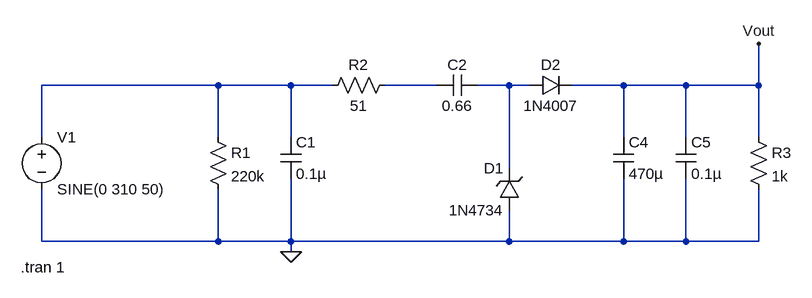
[diagram p0: schematic Transformerless.asc]
Transformerless.asc, the LTspice schematic file:
Version 4
SHEET 1 1796 680
WIRE 208 64 -64 64
WIRE 320 64 208 64
WIRE 384 64 320 64
WIRE 544 64 464 64
WIRE 656 64 608 64
WIRE 688 64 656 64
WIRE 832 64 752 64
WIRE 928 64 832 64
WIRE 1040 64 1040 0
WIRE 1040 64 928 64
WIRE -64 144 -64 64
WIRE 208 144 208 64
WIRE 320 144 320 64
WIRE 832 144 832 64
WIRE 928 144 928 64
WIRE 1040 144 1040 64
WIRE 656 192 656 64
WIRE -64 304 -64 224
WIRE 208 304 208 224
WIRE 208 304 -64 304
WIRE 320 304 320 208
WIRE 320 304 208 304
WIRE 656 304 656 256
WIRE 656 304 320 304
WIRE 832 304 832 208
WIRE 832 304 656 304
WIRE 928 304 928 208
WIRE 928 304 832 304
WIRE 1040 304 1040 224
WIRE 1040 304 928 304
WIRE 320 320 320 304
FLAG 320 320 0
FLAG 1040 0 Vout
SYMBOL voltage -64 128 R0
WINDOW 123 0 0 Left 0
WINDOW 39 0 0 Left 0
SYMATTR InstName V1
SYMATTR Value SINE(0 310 50)
SYMBOL res 192 128 R0
SYMATTR InstName R1
SYMATTR Value 220k
SYMATTR SpiceLine pwr=0.25
SYMBOL cap 304 144 R0
SYMATTR InstName C1
SYMATTR Value 0.1µ
SYMATTR SpiceLine V=275 Irms=0 Rser=0.072 Lser=4.703n mfg="Würth Elektronik" pn="890324025017 WCAP-FTX2 15x18x12x6" type="X2"
SYMBOL res 480 48 R90
WINDOW 0 0 56 VBottom 2
WINDOW 3 32 56 VTop 2
SYMATTR InstName R2
SYMATTR Value 51
SYMATTR SpiceLine pwr=3
SYMBOL cap 608 48 R90
WINDOW 0 0 32 VBottom 2
WINDOW 3 32 32 VTop 2
SYMATTR InstName C2
SYMATTR Value 0.66
SYMBOL zener 672 256 R180
WINDOW 0 24 64 Left 2
WINDOW 3 24 0 Left 2
SYMATTR InstName D1
SYMATTR Value 1N4734
SYMBOL diode 688 80 R270
WINDOW 0 32 32 VTop 2
WINDOW 3 0 32 VBottom 2
SYMATTR InstName D2
SYMATTR Value 1N4007
SYMBOL cap 816 144 R0
SYMATTR InstName C4
SYMATTR Value 470µ
SYMATTR SpiceLine V=10
SYMBOL cap 912 144 R0
SYMATTR InstName C5
SYMATTR Value 0.1µ
SYMATTR SpiceLine V=25
SYMBOL res 1024 128 R0
SYMATTR InstName R3
SYMATTR Value 1k
SYMATTR SpiceLine pwr=0.25
TEXT -96 344 Left 2 !.tran 1

The netlist it stands for:
* Transformerless.asc
V1 N001 0 SINE(0 310 50)
R1 N001 0 220k pwr=0.25
C1 N001 0 0.1µ V=275 Irms=0 Rser=0.072 Lser=4.703n mfg="Würth Elektronik" pn="890324025017 WCAP-FTX2 15x18x12x6" type="X2"
R2 N002 N001 51 pwr=3
C2 N003 N002 0.66
D1 0 N003 1N4734
D2 N003 Vout 1N4007
C4 Vout 0 470µ V=10
C5 Vout 0 0.1µ V=25
R3 Vout 0 1k pwr=0.25
.model D D
.lib standard.dio
.tran 1
.backanno
.end